# EAGLE board M7010X (EAGLE 6.6.0)
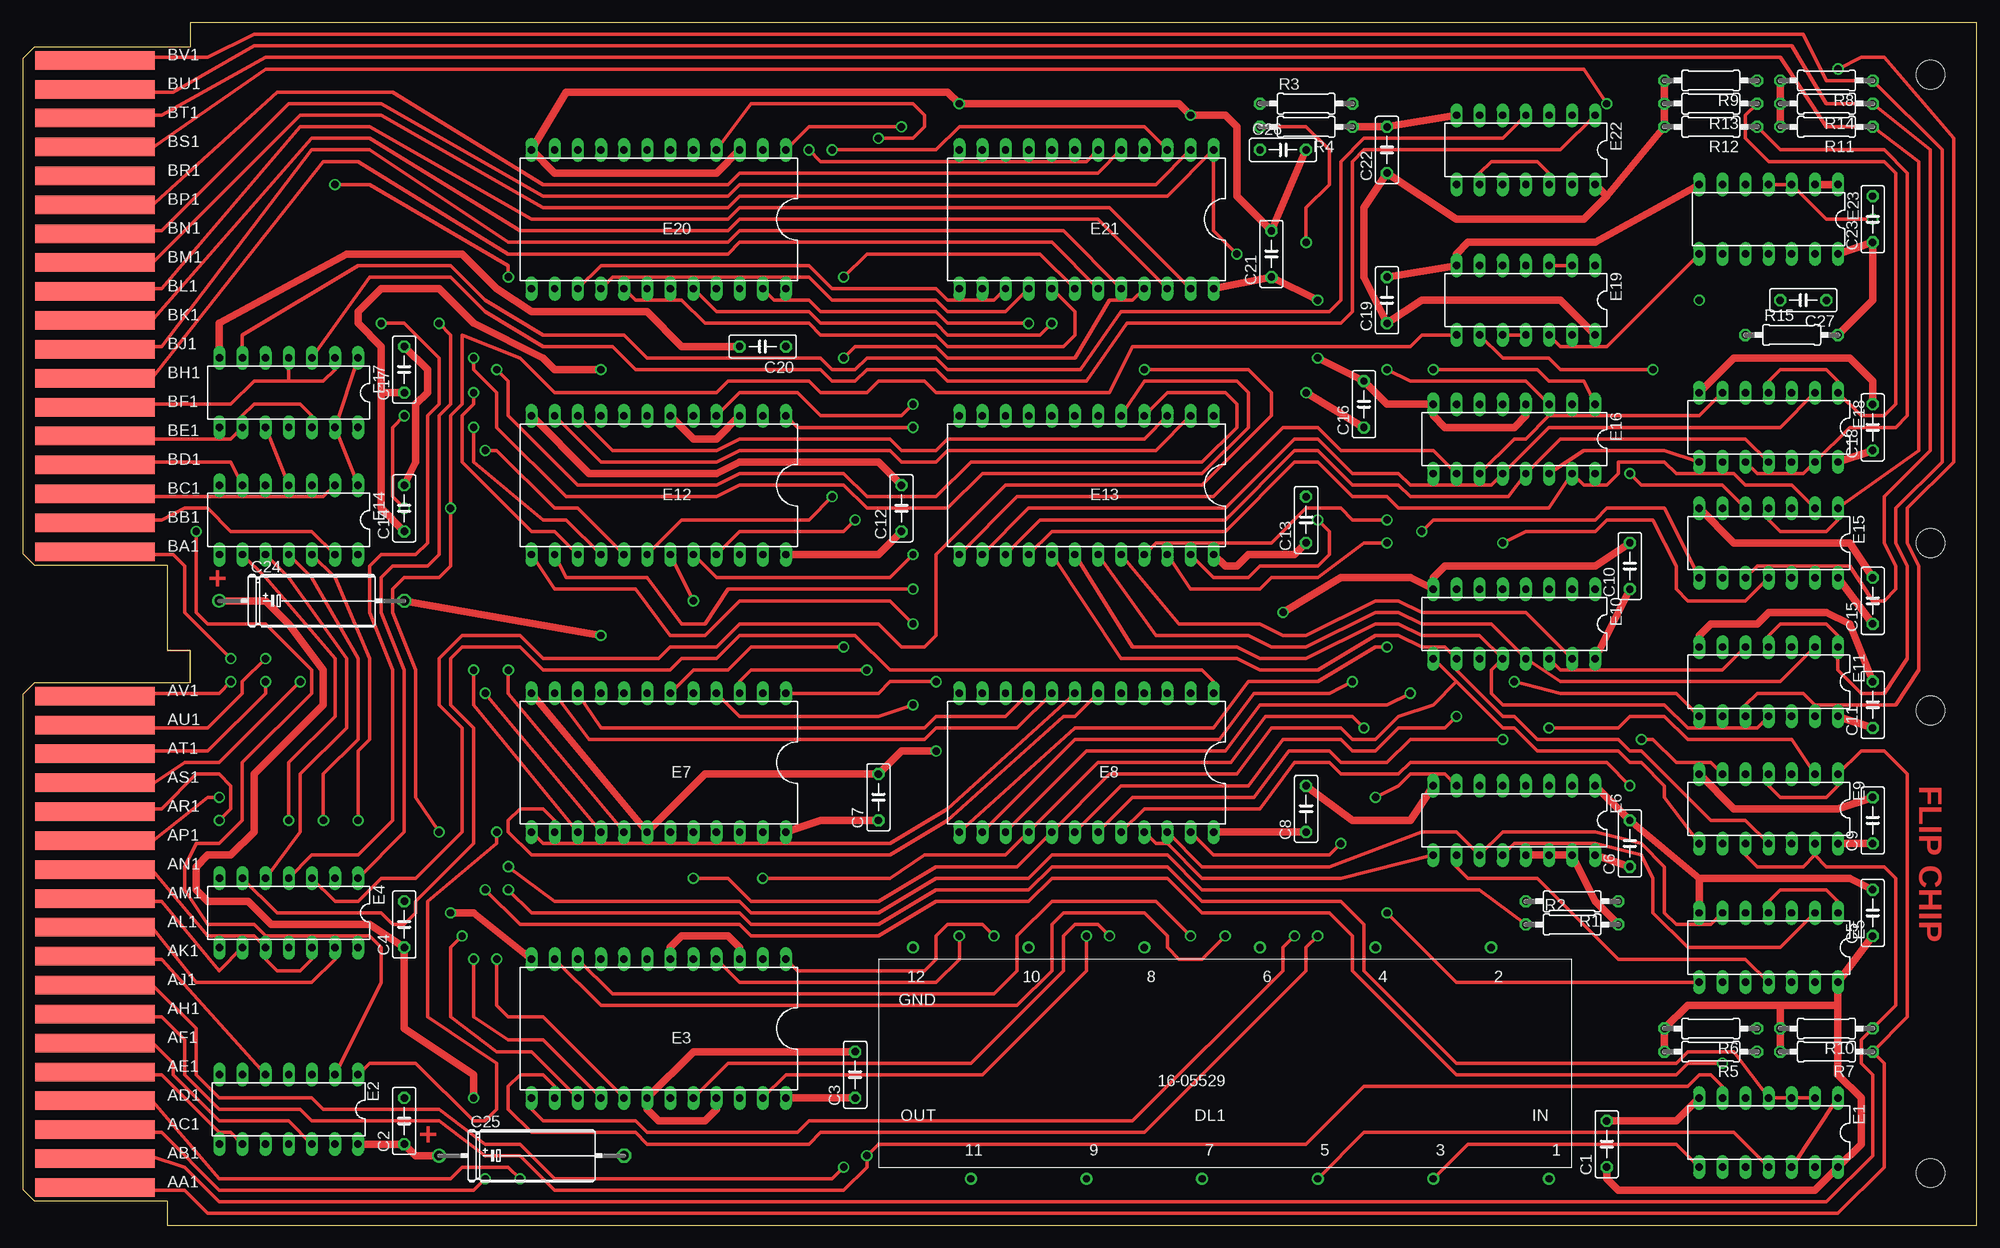
[diagram p2: board, top side]
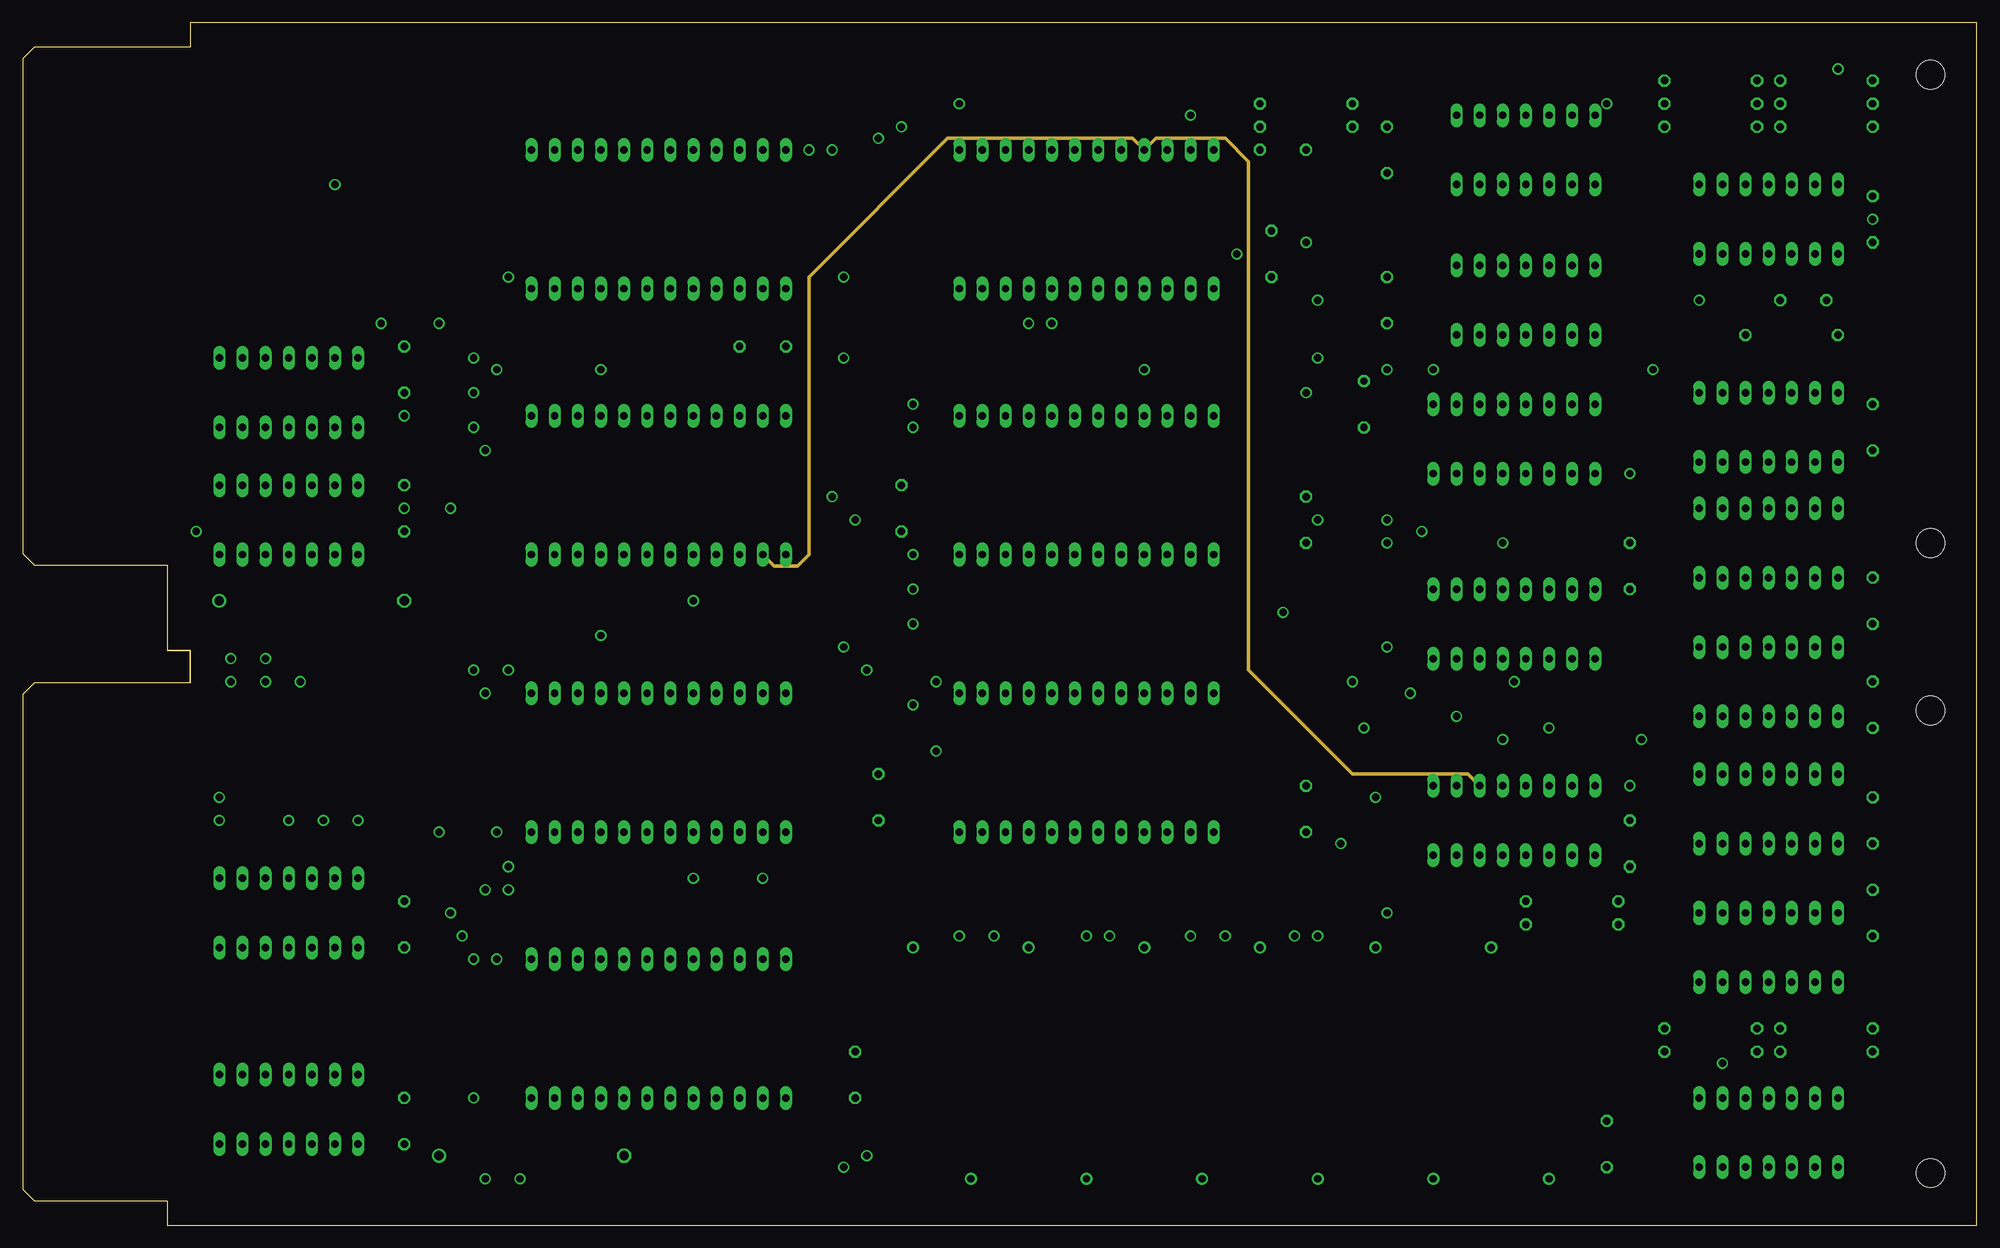
[diagram p3: board, inner layer ECO]
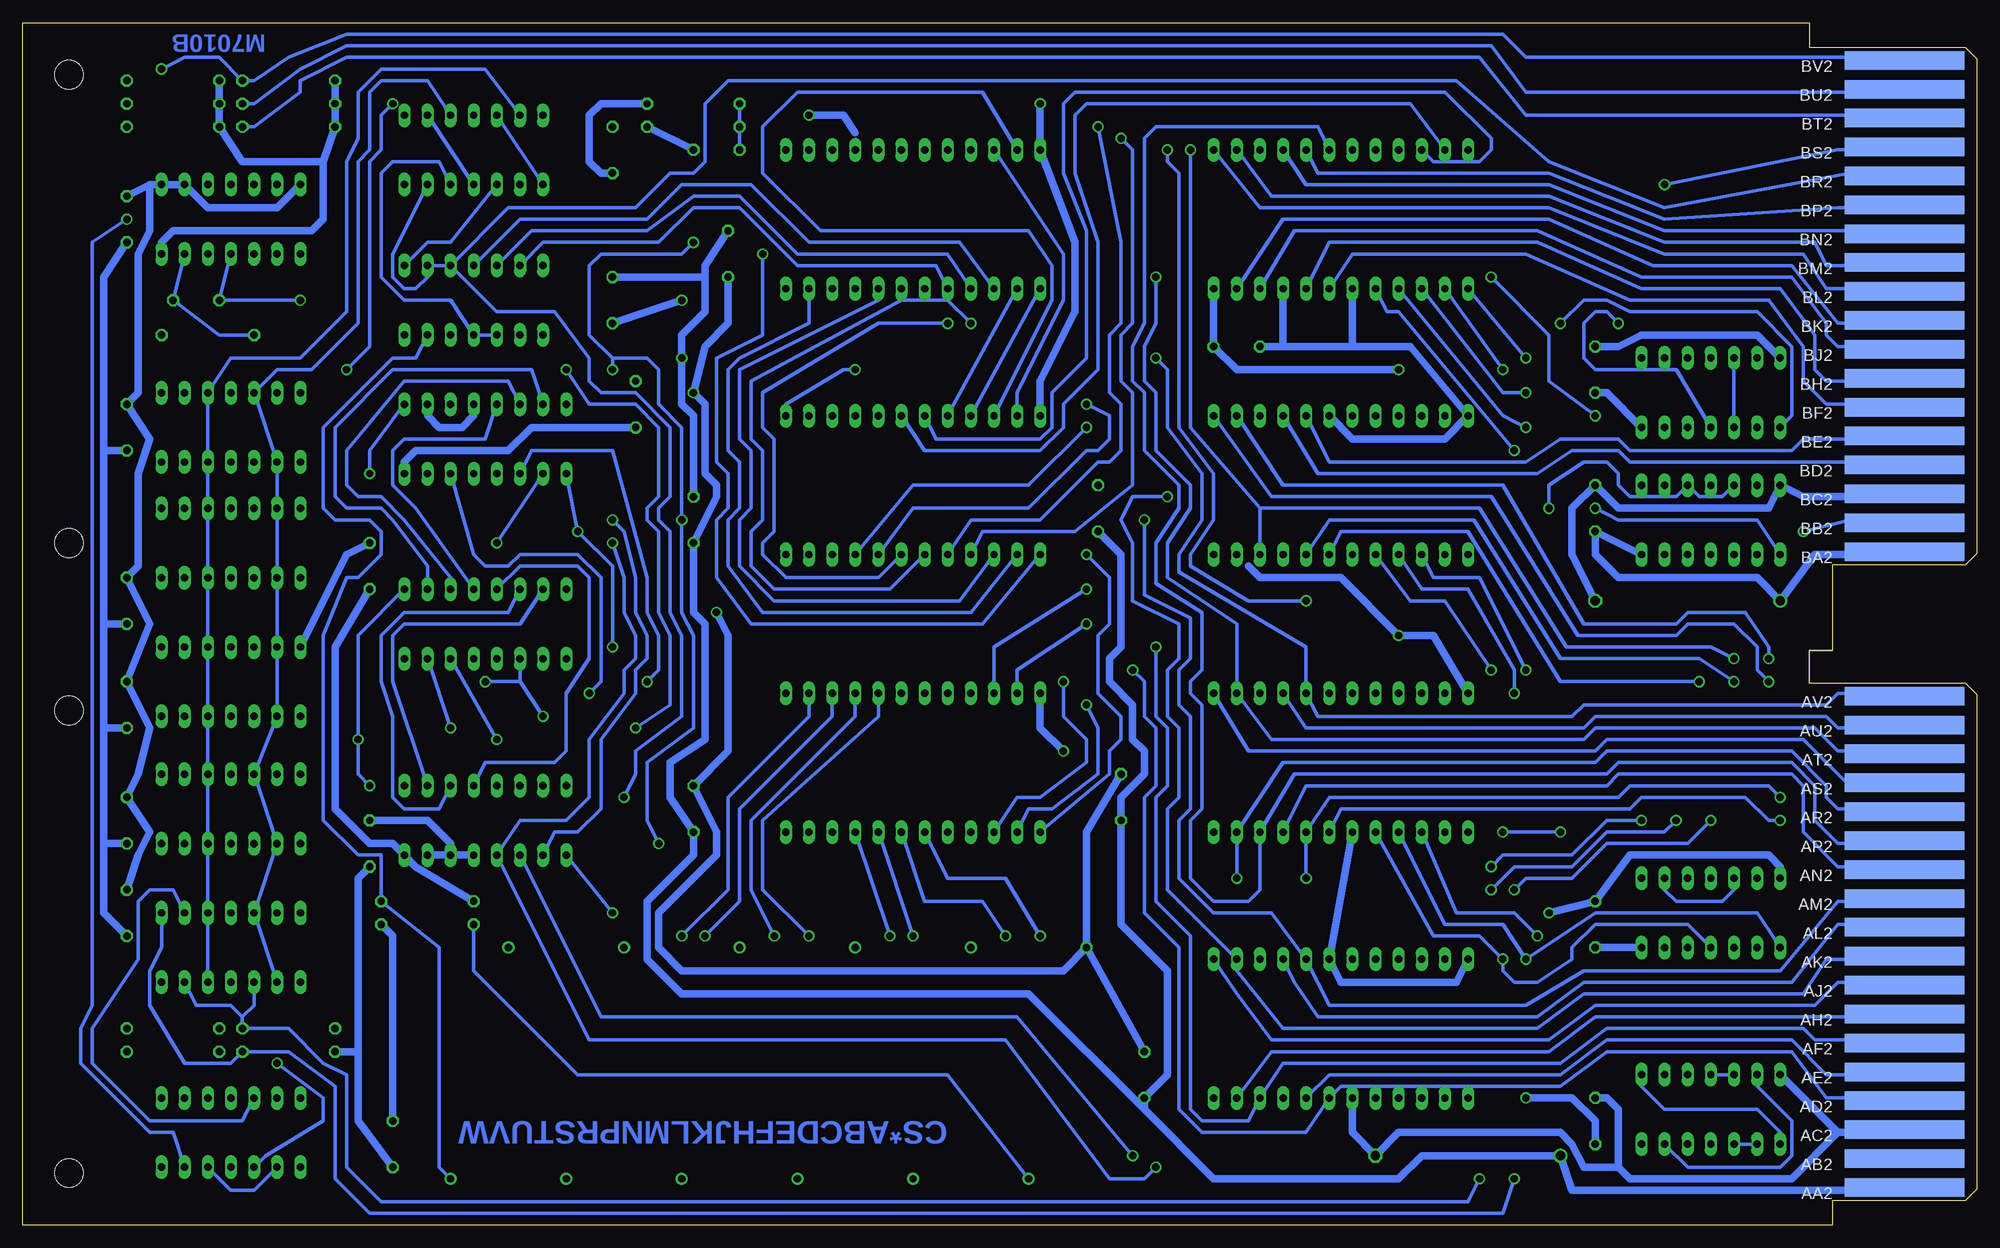
[diagram p4: board, bottom side, seen from below]

Size 214.63 x 132.08 mm. Coordinates in mm from the lower left corner, seen from the top.
Copper layers (1+2+16): Top 0.035mm / dielectric 1.5mm / ECO 0.035mm / dielectric 0.15mm / Bottom 0.035mm
Design rules "16mils *": minimum track width 16mil, minimum drill 32mil, track to track 15mil, track to pad 10mil, pad to pad 10mil, via to via 10mil, smd to smd 10mil, copper to edge 13mil, drill to drill 10mil, minimum pad ring 10mil, minimum via ring 8mil, stop-mask expansion 0mil, vias tented up to drill 0mil, thermal gap 10mil
Net classes: 1 supply: width 0.813 mm

## Footprints (pad centres in the part's own frame; a part is rotated, then mirrored left to right if it is on the bottom)
C050-025X075 = drill 0.813 octagon: 1 -2.54,0; 2 2.54,0
E12-8 = drill 1.016: + -10.16,0 | drill 1.016 octagon: - 10.16,0
16-05529 = drill 0.813: 1 -35.56,12.7; 2 -29.21,-12.7; 3 -22.86,12.7; 4 -16.51,-12.7; 5 -10.16,12.7; 6 -3.81,-12.7; 7 2.54,12.7; 8 8.89,-12.7; 9 15.24,12.7; 10 21.59,-12.7; 11 27.94,12.7; 12 34.29,-12.7
DIL14 = drill 0.813 long: 1 -7.62,-3.81; 2 -5.08,-3.81; 3 -2.54,-3.81; 4 0,-3.81; 5 2.54,-3.81; 6 5.08,-3.81; 7 7.62,-3.81; 8 7.62,3.81; 9 5.08,3.81; 10 2.54,3.81; 11 0,3.81; 12 -2.54,3.81; 13 -5.08,3.81; 14 -7.62,3.81
DIL24 = drill 0.813 long: 1 -12.7,-7.62; 2 -10.16,-7.62; 3 -7.62,-7.62; 4 -5.08,-7.62; 5 -2.54,-7.62; 6 0,-7.62; 7 2.54,-7.62; 8 5.08,-7.62; 9 7.62,-7.62; 10 10.16,-7.62; 11 12.7,-7.62; 12 15.24,-7.62; 13 15.24,7.62; 14 12.7,7.62; 15 10.16,7.62; 16 7.62,7.62; 17 5.08,7.62; 18 2.54,7.62; 19 0,7.62; 20 -2.54,7.62; 21 -5.08,7.62; 22 -7.62,7.62; 23 -10.16,7.62; 24 -12.7,7.62
DIL16 = drill 0.813 long: 1 -8.89,-3.81; 2 -6.35,-3.81; 3 -3.81,-3.81; 4 -1.27,-3.81; 5 1.27,-3.81; 6 3.81,-3.81; 7 6.35,-3.81; 8 8.89,-3.81; 9 8.89,3.81; 10 6.35,3.81; 11 3.81,3.81; 12 1.27,3.81; 13 -1.27,3.81; 14 -3.81,3.81; 15 -6.35,3.81; 16 -8.89,3.81
0207/10 = drill 0.813 octagon: 1 -5.08,0; 2 5.08,0
DOUBLE-LONG = hole 3.175: 209.55,56.515; 209.55,5.715; 209.55,74.93; 209.55,126.365
EDGE-CON4 = smd 13.106 x 2.032: AA1 7.938,4.128; AB1 7.938,7.303; AC1 7.938,10.477; AD1 7.938,13.652; AE1 7.938,16.828; AF1 7.938,20.003; AH1 7.938,23.177; AJ1 7.938,26.352; AK1 7.938,29.527; AL1 7.938,32.703; AM1 7.938,35.877; AN1 7.938,39.053; AP1 7.938,42.227; AR1 7.938,45.403; AS1 7.938,48.578; AT1 7.938,51.752; AU1 7.938,54.928; AV1 7.938,58.102; BA1 7.938,73.978; BB1 7.938,77.153; BC1 7.938,80.328; BD1 7.938,83.502; BE1 7.938,86.677; BF1 7.938,89.853; BH1 7.938,93.028; BJ1 7.938,96.203; BK1 7.938,99.377; BL1 7.938,102.552; BM1 7.938,105.728; BN1 7.938,108.903; BP1 7.938,112.078; BR1 7.938,115.252; BS1 7.938,118.427; BT1 7.938,121.603; BU1 7.938,124.778; BV1 7.938,127.953 | smd 13.106 x 2.032 bottom: AA2 7.938,4.128; AB2 7.938,7.303; AC2 7.938,10.477; AD2 7.938,13.652; AE2 7.938,16.828; AF2 7.938,20.003; AH2 7.938,23.177; AJ2 7.938,26.352; AK2 7.938,29.527; AL2 7.938,32.703; AM2 7.938,35.877; AN2 7.938,39.053; AP2 7.938,42.227; AR2 7.938,45.403; AS2 7.938,48.578; AT2 7.938,51.752; AU2 7.938,54.928; AV2 7.938,58.102; BA2 7.938,73.978; BB2 7.938,77.153; BC2 7.938,80.328; BD2 7.938,83.502; BE2 7.938,86.677; BF2 7.938,89.853; BH2 7.938,93.028; BJ2 7.938,96.203; BK2 7.938,99.377; BL2 7.938,102.552; BM2 7.938,105.728; BN2 7.938,108.903; BP2 7.938,112.078; BR2 7.938,115.252; BS2 7.938,118.427; BT2 7.938,121.603; BU2 7.938,124.778; BV2 7.938,127.953

## Placement (x,y rotation side)
C1  .01uF  [C050-025X075]  173.99,8.89 90 top
C2  .01uF  [C050-025X075]  41.91,11.43 90 top
C3  .01uF  [C050-025X075]  91.44,16.51 90 top
C4  .01uF  [C050-025X075]  41.91,33.02 90 top
C5  .01uF  [C050-025X075]  203.2,34.29 90 top
C6  .01uF  [C050-025X075]  176.53,41.91 90 top
C7  .01uF  [C050-025X075]  93.98,46.99 90 top
C8  .01uF  [C050-025X075]  140.97,45.72 90 top
C9  .01uF  [C050-025X075]  203.2,44.45 90 top
C10  .01uF  [C050-025X075]  176.53,72.39 90 top
C11  .01uF  [C050-025X075]  203.2,57.15 90 top
C12  .01uF  [C050-025X075]  96.52,78.74 90 top
C13  .01uF  [C050-025X075]  140.97,77.47 90 top
C14  .01uF  [C050-025X075]  41.91,78.74 90 top
C15  .01uF  [C050-025X075]  203.2,68.58 90 top
C16  .01uF  [C050-025X075]  147.32,90.17 90 top
C17  .01uF  [C050-025X075]  41.91,93.98 90 top
C18  .01uF  [C050-025X075]  203.2,87.63 90 top
C19  .01uF  [C050-025X075]  149.86,101.6 90 top
C20  .01uF  [C050-025X075]  81.28,96.52 180 top
C21  .01uF  [C050-025X075]  137.16,106.68 90 top
C22  .01uF  [C050-025X075]  149.86,118.11 90 top
C23  .01uF  [C050-025X075]  203.2,110.49 90 top
C24  6.8uF  [E12-8]  31.75,68.58 0 top
C25  6.8uF  [E12-8]  55.88,7.62 0 top
C26  .01uF  [C050-025X075]  138.43,118.11 0 top
C27  10pF  [C050-025X075]  195.58,101.6 180 top
DL1  16-05529  [16-05529]  132.08,17.78 180 top
E1  7402N  [DIL14]  191.77,10.16 180 top
E2  7440N  [DIL14]  29.21,12.7 180 top
E3  N8263  [DIL24]  71.12,21.59 180 top
E4  7400N  [DIL14]  29.21,34.29 180 top
E5  7401N  [DIL14]  191.77,30.48 180 top
E6  7485N  [DIL16]  163.83,44.45 180 top
E7  N8263  [DIL24]  71.12,50.8 180 top
E8  N8202  [DIL24]  118.11,50.8 180 top
E9  7401N  [DIL14]  191.77,45.72 180 top
E10  7485N  [DIL16]  163.83,66.04 180 top
E11  7401N  [DIL14]  191.77,59.69 180 top
E12  N8263  [DIL24]  71.12,81.28 180 top
E13  N8202  [DIL24]  118.11,81.28 180 top
E14  7402N  [DIL14]  29.21,77.47 180 top
E15  7401N  [DIL14]  191.77,74.93 180 top
E16  7485N  [DIL16]  163.83,86.36 180 top
E17  7400N  [DIL14]  29.21,91.44 180 top
E18  7401N  [DIL14]  191.77,87.63 180 top
E19  7402N  [DIL14]  165.1,101.6 180 top
E20  N8263  [DIL24]  71.12,110.49 180 top
E21  N8263  [DIL24]  118.11,110.49 180 top
E22  7400N  [DIL14]  165.1,118.11 180 top
E23  9601  [DIL14]  191.77,110.49 180 top
R1  100  [0207/10]  170.18,35.56 180 top
R2  100  [0207/10]  170.18,33.02 0 top
R3  330  [0207/10]  140.97,123.19 0 top
R4  750  [0207/10]  140.97,120.65 180 top
R5  1K  [0207/10]  185.42,19.05 180 top
R6  1K  [0207/10]  185.42,21.59 180 top
R7  1K  [0207/10]  198.12,19.05 180 top
R8  1K  [0207/10]  198.12,125.73 180 top
R9  1K  [0207/10]  185.42,125.73 180 top
R10  1K  [0207/10]  198.12,21.59 180 top
R11  1K  [0207/10]  198.12,120.65 180 top
R12  1K  [0207/10]  185.42,120.65 180 top
R13  1K  [0207/10]  185.42,123.19 180 top
R14  1K  [0207/10]  198.12,123.19 180 top
R15  4.7K  [0207/10]  194.31,97.79 0 top
U$1  OUTLINE-DOUBLE-LONG  [DOUBLE-LONG]  0,0 0 top
U$3  [EDGE-CON4]  0,0 0 top

## Tracks (layer width: path | path; a pad name or v marks a point on that pad's centre or on a via)
+3V3  (via drill 0.81)
  Top 0.406: E8.23 130.81,40.64 143.51,40.64 v144.78,41.91 | E13.23 130.81,71.12 134.62,71.12 135.89,72.39 142.24,72.39 143.51,73.66 143.51,76.2 v142.24,77.47 | v140.97,107.95 140.97,111.76 143.51,114.3 143.51,118.11 140.97,120.65 R4.2 | E16.3 165.1,92.71 152.4,92.71 v149.86,93.98
  Bottom 0.406: C26.1 R4.2 R3.1 | v140.97,107.95 142.24,106.68 151.13,106.68 152.4,105.41 152.4,97.79 149.86,95.25 | 149.86,95.25 v149.86,93.98 | 149.86,95.25 146.05,95.25 144.78,93.98 144.78,90.17 142.24,87.63 v142.24,77.47 142.24,67.31 140.97,64.77 140.97,54.61 146.05,50.8 146.05,44.45 v144.78,41.91
GND  (via drill 0.81)
  Top 0.813: E17.7 21.59,99.06 35.56,106.68 48.26,106.68 52.07,102.87 55.88,100.33 68.58,100.33 72.39,96.52 C20.2 | E22.7 C22.2 R4.1 | C19.2 E19.7 157.48,106.68 158.75,107.95 172.72,107.95 E23.7 | C17.2 44.45,93.98 44.45,91.44 43.18,90.17 43.18,83.82 C14.2 | C24.- v63.5,64.77 | C1.2 181.61,11.43 E1.7 | E7.12 E7.18 74.93,49.53 C7.2 96.52,52.07 v100.33,52.07 | v46.99,34.29 49.53,34.29 E3.12 | E6.8 152.4,44.45 146.05,44.45 C8.2 | v138.43,67.31 144.78,71.12 152.4,71.12 E10.8 154.94,71.12 156.21,72.39 172.72,72.39 C10.2 | E5.7 184.15,38.1 | 184.15,38.1 200.66,38.1 C5.2 | 184.15,38.1 C6.2 E6.1 | R2.2 172.72,35.56 E6.15 E6.14 E6.13 | C3.2 73.66,19.05 E3.18 68.58,12.7 69.85,11.43 74.93,11.43 76.2,12.7 E3.21 | E3.6 71.12,30.48 72.39,31.75 77.47,31.75 78.74,30.48 E3.3 | C12.2 93.98,83.82 78.74,83.82 76.2,82.55 62.23,82.55 E12.12 | C26.2 C21.2 133.35,113.03 133.35,120.65 132.08,121.92 v128.27,121.92 127,123.19 v102.87,123.19 101.6,124.46 59.69,124.46 E20.12 58.42,115.57 76.2,115.57 E20.3 | E23.2 E23.1 | E16.4 165.1,88.9 163.83,87.63 156.21,87.63 154.94,88.9 E16.8 149.86,90.17 C16.2 v142.24,95.25 | E18.7 187.96,95.25 200.66,95.25 203.2,92.71 C18.2 | E15.7 187.96,74.93 200.66,74.93 C15.2 | E11.7 184.15,64.77 185.42,66.04 190.5,66.04 191.77,67.31 198.12,67.31 200.66,66.04 C11.2 | E12.3 76.2,86.36 73.66,86.36 E12.6 | E9.7 187.96,45.72 199.39,45.72 C9.2
  Bottom 0.813: U$3.AC2 8.89,10.16 15.24,10.16 | 15.24,10.16 20.32,5.08 38.1,5.08 39.37,6.35 | 39.37,6.35 39.37,12.7 40.64,13.97 C2.2 | 39.37,6.35 43.18,6.35 44.45,8.89 45.72,10.16 63.5,10.16 C25.- 68.58,10.16 E3.18 | E2.7 15.24,10.16 | DL1.12 C3.2 | R2.2 173.99,31.75 C1.2 | DL1.12 97.79,43.18 C7.2 | DL1.12 100.33,27.94 142.24,27.94 144.78,30.48 144.78,34.29 138.43,40.64 138.43,43.18 C8.2 137.16,52.07 137.16,64.77 v138.43,67.31 | C24.- 44.45,73.66 44.45,78.74 C14.2 39.37,78.74 22.86,78.74 E14.7 19.05,80.01 10.16,80.01 U$3.BC2 | E3.12 57.15,26.67 69.85,26.67 E3.6 E7.18 | E4.7 21.59,39.37 22.86,40.64 38.1,40.64 C4.2 v46.99,34.29 | E7.12 59.69,64.77 v63.5,64.77 69.85,71.12 78.74,71.12 80.01,72.39 | C20.2 76.2,96.52 | 76.2,96.52 68.58,96.52 | 68.58,96.52 E20.18 | E20.21 76.2,96.52 | 68.58,96.52 62.23,96.52 E12.12 58.42,86.36 68.58,86.36 E12.6 | E17.7 24.13,97.79 36.83,97.79 39.37,96.52 C17.2 | E8.12 102.87,54.61 v100.33,52.07 | E13.12 102.87,92.71 99.06,100.33 99.06,107.95 E21.12 v102.87,123.19 | C26.2 R4.1 | C6.2 170.18,44.45 167.64,41.91 E6.14 | E6.15 E6.14 | E6.13 E6.14 | C10.2 179.07,73.66 E11.7 | C13.2 140.97,88.9 142.24,90.17 v142.24,95.25 142.24,97.79 139.7,100.33 139.7,104.14 | 139.7,104.14 139.7,105.41 C21.2 | C19.2 139.7,104.14 | E16.4 165.1,88.9 166.37,87.63 168.91,87.63 170.18,88.9 E16.2 | E23.7 186.69,111.76 194.31,111.76 E23.2 E23.1 200.66,114.3 | C23.2 200.66,114.3 | 200.66,114.3 200.66,109.22 201.93,106.68 201.93,91.44 C18.2 200.66,86.36 201.93,82.55 201.93,72.39 C15.2 200.66,66.04 C11.2 200.66,54.61 201.93,49.53 C9.2 200.66,43.18 201.93,40.64 C5.2 | v128.27,121.92 124.46,121.92 123.19,120.02
N$1  (via drill 0.81)
  Top 0.406: E5.8 157.48,26.67 v149.86,34.29 | E8.21 124.46,41.91 125.73,41.91 129.54,38.1 144.78,38.1 E6.9 | v119.38,31.75 118.11,33.02 115.57,33.02 114.3,31.75 114.3,27.94 104.14,17.78 77.47,17.78 E3.20
  Bottom 0.406: E3.20 71.12,16.51 45.72,16.51 40.64,20.32 20.32,20.32 16.51,16.51 8.89,16.51 U$3.AE2 | E8.21 v119.38,31.75 | E6.9 v149.86,34.29
N$2  (via drill 0.81)
  Top 0.406: E8.20 123.19,45.72 135.89,45.72 139.7,50.8 143.51,50.8 144.78,49.53 151.13,49.53 152.4,50.8 173.99,50.8 v176.53,48.26 | v116.84,31.75 116.84,27.94 105.41,16.51 83.82,16.51 E3.23 | E9.6 185.42,50.8 181.61,50.8 179.07,53.34 v177.8,53.34
  Bottom 0.406: E3.23 77.47,19.05 46.99,19.05 41.91,22.86 8.89,22.86 U$3.AH2 | E8.20 v116.84,31.75 | E10.1 177.8,64.77 v177.8,53.34 177.8,49.53 v176.53,48.26
N$3  (via drill 0.81)
  Top 0.406: E8.19 121.92,46.99 135.26,46.99 139.07,52.07 143.51,52.07 144.78,50.8 149.86,50.8 152.4,53.34 v162.56,53.34 | v106.68,31.75 105.41,33.02 101.6,33.02 100.33,31.75 100.33,29.21 99.06,27.94 85.09,27.94 E3.1 | E10.14 168.91,60.96 186.69,60.96 E11.5
  Bottom 0.406: U$3.AJ2 8.89,26.67 15.24,26.67 17.78,24.13 41.91,24.13 46.99,20.32 77.47,20.32 81.28,25.4 E3.1 | E8.19 115.57,35.56 109.22,35.56 v106.68,31.75 | E10.14 v162.56,53.34
N$4  (via drill 0.81)
  Top 0.406: E8.18 120.65,48.26 134.62,48.26 138.43,53.34 144.78,53.34 146.05,52.07 148.59,52.07 151.13,54.61 156.21,54.61 v157.48,55.88 | v102.87,31.75 102.87,29.21 100.33,26.67 78.74,26.67 E3.4 | v163.83,59.69 168.91,58.42 181.61,58.42 E11.8
  Bottom 0.406: U$3.AL2 8.89,33.02 15.24,33.02 20.32,26.67 43.18,26.67 48.26,22.86 72.39,22.86 74.93,26.67 E3.4 | E8.18 113.03,38.1 106.68,38.1 v102.87,31.75 | E10.11 160.02,59.69 | 160.02,59.69 v157.48,55.88 | 160.02,59.69 v163.83,59.69
N$5  (via drill 0.81)
  Top 0.406: E7.3 78.74,59.69 80.01,60.96 v92.71,60.96
  Bottom 0.406: U$3.AD2 10.16,13.97 16.51,13.97 20.32,19.05 40.64,19.05 45.72,15.24 69.85,15.24 E3.19 73.66,10.16 85.09,10.16 87.63,12.7 87.63,30.48 91.44,34.29 91.44,46.99 90.17,48.26 90.17,54.61 91.44,55.88 91.44,59.69 v92.71,60.96
N$6  (via drill 0.81)
  Top 0.406: E7.6 73.66,60.96 77.47,60.96 80.01,63.5 v90.17,63.5
  Bottom 0.406: U$3.AF2 8.89,20.32 17.78,20.32 19.05,21.59 40.64,21.59 45.72,17.78 76.2,17.78 E3.22 80.01,11.43 85.09,11.43 86.36,12.7 86.36,31.75 90.17,35.56 90.17,46.99 88.9,48.26 88.9,54.61 90.17,55.88 v90.17,63.5
N$7  (via drill 0.81)
  Top 0.406: v88.9,80.01 86.36,77.47 72.39,77.47 E12.18
  Bottom 0.406: U$3.AK2 8.89,29.21 16.51,29.21 19.05,25.4 43.18,25.4 48.26,21.59 76.2,21.59 81.28,27.94 E3.2 88.9,36.83 88.9,45.72 87.63,46.99 87.63,54.61 88.9,55.88 88.9,60.96 87.63,62.23 87.63,66.04 92.71,68.58 92.71,74.93 93.98,77.47 92.71,80.01 v88.9,80.01
N$8  (via drill 0.81)
  Top 0.406: v91.44,77.47 90.17,76.2 78.74,76.2 E12.21
  Bottom 0.406: U$3.AM2 8.89,35.56 15.24,35.56 21.59,27.94 43.18,27.94 49.53,24.13 71.12,24.13 E3.5 77.47,34.29 83.82,34.29 87.63,38.1 87.63,44.45 86.36,45.72 86.36,55.88 87.63,57.15 87.63,60.96 86.36,62.23 86.36,66.67 91.44,69.22 v91.44,77.47
N$9
  Bottom 0.406: U$3.AN2 8.89,39.37 15.24,39.37 19.05,43.18 19.05,48.26 20.32,49.53 39.37,49.53 40.64,48.26 73.66,48.26 E7.21
N$10  (via drill 0.81)
  Top 0.406: E21.15 106.68,101.6 101.6,101.6 100.33,102.87 88.9,102.87 86.36,105.41 63.5,105.41 E20.15 | E7.15 49.53,57.15 v49.53,60.96 | v49.53,91.44 49.53,90.17 48.26,88.9 48.26,83.82 55.88,76.2 58.42,76.2 E12.15 | E3.15 55.88,19.05 52.07,19.05 46.99,22.86 46.99,30.48 v48.26,31.75
  Bottom 0.406: E7.15 57.15,34.29 50.8,34.29 v48.26,31.75 | E12.15 59.69,71.12 54.61,71.12 v49.53,60.96 | E21.15 111.76,107.95 128.27,107.95 134.62,114.3 142.24,114.3 146.05,110.49 160.02,110.49 E19.4 | E20.15 52.07,91.44 v49.53,91.44
N$11  (via drill 0.81)
  Top 0.406: E20.17 67.31,101.6 72.39,101.6 74.93,99.06 86.36,99.06 87.63,97.79 100.33,97.79 101.6,96.52 114.3,96.52 115.57,97.79 115.57,100.33 E21.17 | E7.17 53.34,58.42 v53.34,60.96 | v50.8,85.09 52.07,85.09 58.42,78.74 60.96,78.74 E12.17 | E3.17 57.15,22.86 53.34,22.86 52.07,24.13 v52.07,29.21
  Bottom 0.406: E4.11 31.75,33.02 41.91,33.02 44.45,30.48 44.45,29.21 48.26,26.67 50.8,26.67 52.07,27.94 v52.07,29.21 54.61,31.75 59.69,31.75 E7.17 | E12.17 62.23,68.58 58.42,68.58 v53.34,60.96 | E19.6 157.48,107.95 144.78,107.95 140.97,111.76 135.89,111.76 129.54,105.41 114.3,105.41 E21.17 | E20.17 64.77,100.33 63.5,100.33 v50.8,85.09
N$12  (via drill 0.81)
  Top 0.406: E21.16 107.95,100.33 101.6,100.33 100.33,101.6 88.9,101.6 86.36,104.14 64.77,104.14 E20.16 | E7.16 v50.8,58.42 | v49.53,87.63 49.53,83.82 57.15,77.47 59.69,77.47 E12.16 | E3.16 57.15,20.32 53.34,20.32 49.53,22.86 v49.53,29.21
  Bottom 0.406: E4.8 24.13,34.29 41.91,34.29 v49.53,29.21 52.07,33.02 58.42,33.02 E7.16 | E12.16 60.96,69.85 55.88,69.85 50.8,60.96 v50.8,58.42 | E21.16 113.03,106.68 129.54,106.68 135.89,113.03 140.97,113.03 146.05,109.22 158.75,109.22 E19.5 | E20.16 52.07,88.9 v49.53,87.63
N$13  (via drill 0.81)
  Top 0.406: E21.21 121.92,101.6 119.38,101.6 115.57,95.25 101.6,95.25 100.33,96.52 91.44,96.52 v90.17,95.25
  Bottom 0.406: U$3.AV2 8.89,58.42 15.24,58.42 16.51,57.15 43.18,57.15 44.45,55.88 72.39,55.88 E7.5 73.66,63.5 87.63,71.75 87.63,73.66 85.09,77.47 85.09,82.55 88.9,87.63 88.9,93.98 v90.17,95.25
N$14  (via drill 0.81)
  Top 0.406: v90.17,104.14 92.71,106.68 111.76,106.68 E21.18
  Bottom 0.406: U$3.AT2 8.89,52.07 15.24,52.07 17.78,54.61 41.91,54.61 43.18,53.34 77.47,53.34 E7.2 81.28,66.04 88.9,71.12 88.9,74.93 86.36,78.74 86.36,81.28 90.17,85.09 90.17,91.44 91.44,92.71 91.44,96.52 90.17,99.06 v90.17,104.14
N$15
  Bottom 0.406: U$3.AP2 8.89,41.91 15.24,41.91 17.78,44.45 17.78,48.26 20.32,50.8 39.37,50.8 40.64,49.53 74.93,49.53 E7.22 78.74,36.83 80.01,35.56 83.82,35.56 86.36,38.1 86.36,44.45 85.09,45.72 85.09,57.15 86.36,58.42 86.36,59.69 85.09,60.96 85.09,67.31 90.17,70.48 90.17,74.93 87.63,78.74 87.63,81.28 91.44,85.09 91.44,91.44 92.71,92.71 92.71,96.52 91.44,99.06 91.44,119.38 90.17,120.65 72.39,120.65 E20.6
N$16  (via drill 0.81)
  Top 0.406: U$3.AP1 8.89,41.91 13.97,41.91 20.32,46.99 v21.59,46.99 | v73.66,38.1 77.47,38.1 80.01,35.56 93.98,35.56 100.33,39.37 109.22,39.37 E8.17 119.38,49.53 133.35,49.53 137.16,54.61 144.78,54.61 146.05,53.34 148.59,53.34 151.13,55.88 154.94,57.15 157.48,59.69 | E10.9 157.48,59.69 | 157.48,59.69 162.56,54.61 163.83,54.61 166.37,52.07 175.26,52.07 176.53,50.8 177.8,50.8 180.34,48.26 180.34,46.99 E9.8
  Bottom 0.406: v73.66,38.1 E7.20 71.12,46.99 39.37,46.99 38.1,48.26 22.86,48.26 v21.59,46.99
N$17  (via drill 0.81)
  Top 0.406: v50.8,36.83 54.61,33.02 78.74,33.02 80.01,31.75 93.98,31.75 100.33,35.56 110.49,35.56 113.03,38.1 125.73,38.1 129.54,34.29 143.51,34.29 146.05,31.75 146.05,27.94 157.48,16.51 181.61,16.51 182.88,17.78 v186.69,17.78 | E14.9 26.67,71.12 34.29,62.23 34.29,55.88 29.21,50.8 v29.21,44.45
  Bottom 0.406: v29.21,44.45 31.75,41.91 40.64,41.91 44.45,38.1 49.53,38.1 v50.8,36.83 | E1.10 187.96,7.62 181.61,11.43 181.61,13.97 v186.69,17.78
N$18  (via drill 0.81)
  Top 0.406: E8.15 116.84,52.07 132.08,52.07 135.89,57.15 149.86,57.15 v152.4,58.42 | E18.8 180.34,85.09 171.45,85.09 E16.14 | E7.1 93.98,58.42 95.25,59.69 v100.33,59.69
  Bottom 0.406: U$3.AS2 10.16,48.26 13.97,48.26 19.05,53.34 40.64,53.34 41.91,52.07 80.01,52.07 E7.1 | E8.15 105.41,46.99 102.87,46.99 97.79,50.8 97.79,53.34 100.33,55.88 v100.33,59.69 | E16.14 165.1,73.66 163.83,72.39 161.29,72.39 160.02,73.66 153.67,73.66 151.13,71.12 151.13,59.69 v152.4,58.42
N$19  (via drill 0.81)
  Top 0.406: E15.5 186.69,81.28 177.8,81.28 v176.53,82.55 | v81.28,38.1 95.25,38.1 99.06,40.64 107.95,40.64 E8.16 118.11,50.8 132.72,50.8 136.53,55.88 146.05,55.88 v147.32,54.61 | v154.94,93.98 166.37,93.98 167.64,92.71 171.45,92.71 E16.1
  Bottom 0.406: v81.28,38.1 E7.23 76.2,50.8 41.91,50.8 40.64,52.07 20.32,52.07 16.51,48.26 16.51,46.99 15.24,45.72 8.89,45.72 U$3.AR2 | E16.1 176.53,85.09 v176.53,82.55 | v147.32,54.61 143.51,57.15 143.51,64.77 144.78,67.31 144.78,76.2 146.05,77.47 146.05,78.74 144.78,80.01 144.78,87.63 147.32,90.17 152.4,90.17 v154.94,93.98
N$20  (via drill 0.81)
  Top 0.406: v21.59,44.45 22.86,45.72 22.86,48.26 21.59,49.53 19.05,49.53 15.24,45.72 8.89,45.72 U$3.AR1
  Bottom 0.406: E7.19 69.85,45.72 38.1,45.72 36.83,46.99 25.4,46.99 22.86,44.45 v21.59,44.45
N$21
  Top 0.406: E7.14 58.42,44.45 57.15,45.72 54.61,45.72 53.34,44.45 53.34,43.18 55.88,40.64 95.25,40.64 101.6,44.45 114.3,55.88 115.57,55.88 E8.6
N$22
  Top 0.406: E7.13 57.15,41.91 95.25,41.91 101.6,45.72 E8.7
N$23
  Top 0.406: E7.11 62.23,53.34 99.06,53.34 100.33,54.61 109.22,54.61 E8.8
N$24
  Top 0.406: E7.10 63.5,54.61 99.06,54.61 100.33,55.88 107.95,55.88 E8.9
N$25  (via drill 0.81)
  Top 0.406: v128.27,31.75 124.46,35.56 113.03,35.56 109.22,31.75 109.22,27.94 106.68,25.4 64.77,25.4 E3.10
  Bottom 0.406: E8.5 120.65,55.88 133.35,44.45 133.35,36.83 v128.27,31.75
N$26  (via drill 0.81)
  Top 0.406: v132.08,31.75 129.54,29.21 127,29.21 125.73,30.48 125.73,31.75 123.19,34.29 114.3,34.29 113.03,33.02 113.03,27.94 109.22,24.13 63.5,24.13 E3.11
  Bottom 0.406: E8.4 123.19,55.88 134.62,44.45 134.62,36.83 v132.08,31.75
N$27  (via drill 0.81)
  Top 0.406: E3.13 55.88,12.7 57.15,11.43 67.31,11.43 68.58,10.16 85.09,10.16 86.36,11.43 121.92,11.43 138.43,27.94 138.43,30.48 v139.7,31.75
  Bottom 0.406: E8.3 125.73,55.88 135.89,45.72 135.89,35.56 v139.7,31.75
N$28  (via drill 0.81)
  Top 0.406: v142.24,31.75 140.97,30.48 140.97,27.94 123.19,10.16 87.63,10.16 86.36,8.89 68.58,8.89 67.31,10.16 55.88,10.16 53.34,12.7 53.34,15.24 54.61,16.51 57.15,16.51 58.42,15.24 E3.14
  Bottom 0.406: E8.2 128.27,55.88 137.16,46.99 137.16,36.83 v142.24,31.75
N$29  (via drill 0.81)
  Top 0.406: v97.79,69.85 77.47,69.85 74.93,66.04 72.39,66.04 68.58,71.12 59.69,71.12 E12.14
  Bottom 0.406: E8.10 107.95,63.5 v97.79,69.85
N$30  (via drill 0.81)
  Top 0.406: E12.13 58.42,69.85 67.31,69.85 71.12,64.77 74.93,64.77 78.74,68.58 95.25,68.58 v97.79,66.04
  Bottom 0.406: E8.11 105.41,60.96 v97.79,66.04
N$31  (via drill 0.81)
  Top 0.406: E13.4 125.73,91.44 132.08,91.44 133.35,90.17 133.35,87.63 129.54,83.82 104.14,83.82 100.33,80.01 92.71,80.01 90.17,82.55 78.74,82.55 76.2,81.28 60.96,81.28 53.34,88.9 53.34,92.71 v52.07,93.98
  Bottom 0.406: E20.14 v52.07,93.98
N$32  (via drill 0.81)
  Top 0.406: E13.5 123.19,92.71 133.35,92.71 134.62,91.44 134.62,87.63 129.54,82.55 105.41,82.55 101.6,78.74 92.71,78.74 90.17,81.28 78.74,81.28 76.2,80.01 59.69,80.01 52.07,87.63 52.07,91.44 49.53,93.98 v49.53,95.25
  Bottom 0.406: E20.13 v49.53,95.25
N$33
  Bottom 0.406: E20.11 62.23,123.19 97.79,123.19 99.06,121.92 99.06,115.57 96.52,107.95 96.52,93.98 100.33,90.17 100.33,87.63 102.87,85.09 115.57,85.09 E13.6
N$34
  Bottom 0.406: E20.10 59.69,116.84 54.61,116.84 53.34,118.11 53.34,119.38 58.42,124.46 99.06,124.46 100.33,123.19 100.33,115.57 97.79,109.22 97.79,95.25 101.6,91.44 101.6,87.63 102.87,86.36 114.3,86.36 E13.7
N$35
  Top 0.406: E12.10 64.77,85.09 76.2,85.09 78.74,86.36 95.25,86.36 96.52,85.09 100.33,85.09 101.6,86.36 123.19,86.36 E13.3
N$36
  Top 0.406: E12.11 63.5,83.82 76.2,83.82 78.74,85.09 95.25,85.09 96.52,83.82 100.33,83.82 101.6,85.09 124.46,85.09 E13.2
N$37
  Bottom 0.406: E13.10 101.6,101.6 101.6,105.41 104.14,109.22 127,109.22 133.35,115.57 133.35,120.65 129.54,124.46 109.22,124.46 E21.11
N$38
  Bottom 0.406: E13.8 E21.14
N$39
  Bottom 0.406: E21.13 E13.9
N$40
  Bottom 0.406: E13.11 105.41,91.44 100.33,101.6 100.33,106.68 E21.10
N$41  (via drill 0.81)
  Top 0.406: U$3.AC1 8.89,10.16 15.24,10.16 21.59,3.81 49.53,3.81 v50.8,5.08 | E5.4 191.77,35.56 193.04,36.83 198.12,36.83 199.39,35.56 E5.1
  Bottom 0.406: E5.1 199.39,30.48 200.66,27.94 200.66,24.13 196.85,17.78 191.77,17.78 R5.1 185.42,19.05 180.34,15.24 180.34,5.08 176.53,1.27 52.07,1.27 v50.8,5.08
N$42  (via drill 0.81)
  Top 0.406: U$3.AD1 8.89,13.97 13.97,13.97 21.59,5.08 46.99,5.08 48.26,6.35 53.34,6.35 v54.61,5.08
  Bottom 0.406: E5.13 195.58,24.13 191.77,24.13 190.5,22.86 | 190.5,22.86 R6.1 185.42,21.59 181.61,17.78 179.07,16.51 179.07,6.35 175.26,2.54 55.88,2.54 v54.61,5.08 | E5.10 189.23,24.13 190.5,22.86
N$43
  Top 0.406: U$3.BU1 8.89,124.46 16.51,124.46 25.4,129.54 194.31,129.54 198.12,123.19 R14.1 209.55,118.11 209.55,85.09 204.47,80.01 204.47,74.93 205.74,72.39 205.74,69.85 204.47,68.58 203.2,68.58 200.66,72.39 196.85,72.39 | E15.10 190.5,72.39 196.85,72.39 | 196.85,72.39 E15.13
N$44
  Top 0.406: R13.1 189.23,121.92 189.23,119.38 191.77,116.84 204.47,116.84 205.74,115.57 205.74,90.17 204.47,88.9 201.93,88.9 E18.1 199.39,92.71 198.12,93.98 193.04,93.98 191.77,92.71 E18.4
  Bottom 0.406: U$3.BU2 8.89,124.46 49.53,124.46 53.34,129.54 179.07,129.54 184.15,127 189.23,123.19 R13.1
N$45
  Top 0.406: R12.1 193.04,118.11 204.47,118.11 207.01,115.57 207.01,88.9 205.74,87.63 200.66,87.63 E18.13 195.58,82.55 190.5,82.55 E18.10
  Bottom 0.406: U$3.BT2 8.89,121.92 49.53,121.92 54.61,128.27 179.07,128.27 184.15,125.73 184.15,124.46 189.23,120.65 R12.1
N$46
  Top 0.406: U$3.BT1 8.89,121.92 15.24,121.92 26.67,128.27 193.04,128.27 198.12,120.65 R11.1 208.28,116.84 208.28,85.09 E15.1 199.39,77.47 198.12,76.2 193.04,76.2 191.77,77.47 E15.4
N$47
  Top 0.406: U$3.AB1 8.89,7.62 13.97,7.62 17.78,6.35 21.59,2.54 198.12,2.54 203.2,7.62 203.2,16.51 201.93,17.78 201.93,20.32 R10.1 205.74,24.13 205.74,38.1 204.47,39.37 198.12,39.37 196.85,40.64 | 196.85,40.64 E9.13 196.85,40.64 | E9.10 189.23,40.64 190.5,39.37 195.58,39.37 196.85,40.64
N$48
  Top 0.406: U$3.AA1 7.62,3.81 17.78,3.81 20.32,1.27 199.39,1.27 204.47,6.35 204.47,17.78 R7.1 207.01,22.86 207.01,49.53 204.47,52.07 201.93,52.07 E9.1 199.39,48.26 198.12,46.99 193.04,46.99 191.77,48.26 E9.4
N$49
  Top 0.406: U$3.BV1 8.89,128.27 20.32,128.27 25.4,130.81 195.58,130.81 198.12,125.73 R8.1 210.82,118.11 210.82,83.82 205.74,78.74 205.74,74.93 207.01,72.39 207.01,62.23 204.47,58.42 201.93,58.42 199.39,60.96 E11.1 199.39,64.77 198.12,66.04 193.04,66.04 191.77,64.77 E11.4
N$50  (via drill 0.81)
  Top 0.406: v199.39,127 201.93,128.27 204.47,128.27 212.09,119.38 212.09,83.82 207.01,78.74 207.01,74.93 208.28,72.39 208.28,60.96 205.74,57.15 196.85,57.15 | 196.85,57.15 E11.13 | E11.10 189.23,57.15 190.5,58.42 195.58,58.42 196.85,57.15
  Bottom 0.406: U$3.BV2 10.16,128.27 49.53,128.27 52.07,130.81 179.07,130.81 185.42,128.27 189.23,125.73 R9.1 193.04,128.27 196.85,128.27 v199.39,127
N$51  (via drill 0.81)
  Top 0.406: E1.2 E1.3 E1.4 187.96,19.05 182.88,19.05 181.61,17.78 157.48,17.78 147.32,27.94 147.32,33.02 144.78,35.56 129.54,35.56 125.73,39.37 113.03,39.37 110.49,36.83 100.33,36.83 93.98,33.02 80.01,33.02 78.74,34.29 55.88,34.29 v53.34,36.83 | E14.11 31.75,71.12 36.83,62.23 36.83,53.34 33.02,49.53 v33.02,44.45
  Bottom 0.406: v33.02,44.45 34.29,43.18 40.64,43.18 44.45,39.37 50.8,39.37 v53.34,36.83
N$52  (via drill 0.81)
  Top 0.406: R2.1 160.02,36.83 129.54,36.83 125.73,40.64 113.03,40.64 110.49,38.1 100.33,38.1 93.98,34.29 80.01,34.29 78.74,35.56 58.42,35.56 v53.34,39.37 | v36.83,44.45 36.83,52.07 38.1,53.34 38.1,62.23 34.29,71.12 E14.12
  Bottom 0.406: v36.83,44.45 40.64,44.45 44.45,40.64 52.07,40.64 v53.34,39.37 | DL1.11 113.03,16.51 153.67,16.51 165.1,27.94 R2.1
N$53  (via drill 0.81)
  Top 0.406: E2.1 38.1,17.78 43.18,17.78 49.53,11.43 50.8,11.43 52.07,12.7 52.07,17.78 44.45,22.86 44.45,35.56 52.07,41.91 v52.07,43.18 | v45.72,43.18 43.18,46.99 43.18,60.96 40.64,67.31 40.64,69.85 41.91,71.12 45.72,71.12 46.99,72.39 v46.99,78.74 46.99,88.9 48.26,90.17 48.26,97.79 54.61,95.25 58.42,91.44 76.2,91.44 77.47,92.71 86.36,92.71 87.63,91.44 92.71,91.44 93.98,92.71 99.06,92.71 100.33,91.44 119.38,91.44 121.92,96.52 152.4,96.52 153.67,97.79 E19.8
  Bottom 0.406: v45.72,43.18 v52.07,43.18 | E2.8 21.59,10.16 24.13,12.7 34.29,12.7 36.83,15.24 E2.1 | E14.5 27.94,80.01 30.48,80.01 E14.3 33.02,80.01 38.1,80.01 39.37,81.28 39.37,82.55 40.64,83.82 43.18,83.82 46.99,81.28 v46.99,78.74
N$54  (via drill 0.81)
  Top 0.406: v90.17,6.35 88.9,5.08 58.42,5.08 54.61,8.89 50.8,8.89 45.72,12.7 33.02,12.7 31.75,13.97 21.59,13.97 19.05,16.51 19.05,21.59 13.97,26.67 8.89,26.67 U$3.AJ1 | E13.22 128.27,69.85 135.89,69.85 137.16,71.12 142.24,71.12 147.32,74.93 v149.86,74.93 | E5.2 193.04,30.48 182.88,30.48 179.07,34.29 179.07,38.1 177.8,40.64 172.72,41.91 163.83,41.91 E6.12
  Bottom 0.406: v90.17,6.35 91.44,5.08 95.25,5.08 106.68,20.32 152.4,20.32 E6.12 160.02,44.45 154.94,44.45 152.4,46.99 152.4,53.34 148.59,58.42 148.59,60.96 147.32,62.23 147.32,64.77 148.59,67.31 148.59,71.12 v149.86,74.93 | E5.2 198.12,36.83 200.66,36.83 201.93,35.56 201.93,29.21 207.01,21.59 207.01,17.78 200.66,11.43 190.5,11.43 E1.5
N$55  (via drill 0.81)
  Top 0.406: U$3.AH1 8.89,22.86 15.24,22.86 17.78,20.32 17.78,16.51 21.59,12.7 30.48,12.7 31.75,11.43 45.72,11.43 50.8,7.62 54.61,7.62 58.42,3.81 90.17,3.81 92.71,6.35 v92.71,7.62 93.98,8.89 140.97,8.89 147.32,15.24 182.88,15.24 184.15,16.51 185.42,16.51 186.69,15.24 E1.6 | E8.22 129.54,39.37 143.51,39.37 153.67,43.18 157.48,43.18 E6.11 162.56,43.18 172.72,43.18 177.8,41.91 180.34,39.37 180.34,34.29 181.61,33.02 185.42,33.02 E5.6
  Bottom 0.406: E6.11 151.13,22.86 105.41,22.86 v92.71,7.62
N$56  (via drill 0.81)
  Top 0.406: U$3.AV1 8.89,58.42 21.59,58.42 v22.86,59.69 | v97.79,87.63 85.09,87.63 E12.1 | v149.86,77.47 146.05,77.47 144.78,78.74 140.97,78.74 137.16,74.93 124.46,74.93 E13.21 | E6.10 157.48,39.37 158.75,38.1 166.37,38.1 175.26,29.21 189.23,29.21 E5.11
  Bottom 0.406: E12.1 77.47,80.01 53.34,80.01 43.82,64.77 33.02,64.77 31.75,66.04 26.67,66.04 24.13,63.5 24.13,60.96 v22.86,59.69 | E13.21 116.84,81.28 104.14,81.28 v97.79,87.63 | E6.10 156.21,43.18 153.67,43.18 151.13,45.72 151.13,53.34 147.32,58.42 147.32,60.96 146.05,62.23 146.05,64.77 147.32,67.31 147.32,71.12 148.59,76.2 v149.86,77.47
N$58  (via drill 0.81)
  Top 0.406: v97.79,90.17 96.52,88.9 87.63,88.9 85.09,91.44 78.74,91.44 E12.4 | E13.20 127,66.04 135.89,66.04 138.43,64.77 140.97,64.77 148.59,68.58 151.13,68.58 153.67,67.31 165.1,67.31 E10.15 | E9.2 194.31,53.34 182.88,53.34 180.34,55.88 176.53,55.88 175.26,54.61 v167.64,54.61
  Bottom 0.406: U$3.BD2 8.89,83.82 38.1,83.82 39.37,85.09 44.45,85.09 48.26,82.55 72.39,82.55 E12.4 | E13.20 116.84,78.74 104.14,78.74 97.79,85.09 96.52,85.09 95.25,86.36 95.25,88.9 v97.79,90.17 | E10.15 v167.64,54.61
N$60  (via drill 0.81)
  Top 0.406: E20.20 76.2,100.33 86.36,100.33 87.63,99.06 100.33,99.06 101.6,97.79 111.76,97.79 v113.03,99.06 | E13.19 124.46,64.77 134.62,64.77 137.16,63.5 140.97,63.5 148.59,67.31 151.13,67.31 153.67,66.04 161.29,66.04 E10.13 168.91,59.69 193.04,59.69 E11.2
  Bottom 0.406: U$3.BH2 8.89,92.71 16.51,92.71 17.78,93.98 17.78,97.79 21.59,102.87 36.83,102.87 48.26,107.95 71.12,107.95 E20.20 | E13.19 120.65,71.12 130.81,71.12 133.35,73.66 133.35,74.93 132.08,76.2 132.08,86.36 133.35,87.63 133.35,91.44 120.65,99.06 v113.03,99.06
N$62  (via drill 0.81)
  Top 0.406: v110.49,99.06 101.6,99.06 100.33,100.33 87.63,100.33 86.36,101.6 82.55,101.6 E20.23 | E13.18 121.92,63.5 133.35,63.5 135.89,62.23 140.97,62.23 148.59,66.04 151.13,66.04 153.67,64.77 160.02,64.77 E10.12 161.29,60.96 161.29,58.42 162.56,57.15 180.34,57.15 182.88,54.61 190.5,54.61 E11.11
  Bottom 0.406: E20.23 76.2,110.49 46.99,110.49 35.56,105.41 20.32,105.41 15.24,99.06 8.89,99.06 U$3.BK2 | E13.18 119.38,69.85 132.08,69.85 134.62,72.39 134.62,76.2 133.35,77.47 133.35,85.09 134.62,86.36 134.62,92.71 118.11,101.6 113.03,101.6 v110.49,99.06
N$63  (via drill 0.81)
  Top 0.406: U$3.BS1 8.89,118.11 13.97,118.11 26.67,127 171.45,127 v173.99,123.19 | E19.9 162.56,95.25 167.64,95.25 168.91,93.98 v179.07,93.98
  Bottom 0.406: v173.99,123.19 175.26,121.92 175.26,118.11 176.53,116.84 176.53,96.52 v179.07,93.98
N$64  (via drill 0.81)
  Top 0.406: E13.17 120.65,62.23 133.35,62.23 135.89,60.96 142.24,60.96 148.59,64.77 151.13,64.77 153.67,63.5 156.21,63.5 E10.10 157.48,60.96 162.56,55.88 163.83,55.88 166.37,53.34 175.26,53.34 176.53,52.07 177.8,52.07 185.42,44.45 189.23,44.45 E9.11 | E20.1 86.36,120.65 v96.52,120.65
  Bottom 0.406: U$3.BL2 10.16,102.87 16.51,102.87 19.05,106.68 34.29,106.68 46.99,111.76 78.74,111.76 E20.1 | E13.17 110.49,77.47 102.87,77.47 96.52,83.82 95.25,83.82 93.98,85.09 93.98,90.17 95.25,91.44 95.25,97.79 93.98,99.06 93.98,107.95 v96.52,120.65
N$65  (via drill 0.81)
  Top 0.406: U$3.AT1 8.89,52.07 20.32,52.07 26.67,58.42 v26.67,59.69 | v153.67,76.2 154.94,77.47 172.72,77.47 173.99,78.74 180.34,78.74 E15.8 | E8.13 115.57,54.61 130.81,54.61 134.62,59.69 142.24,59.69 148.59,63.5 v149.86,63.5 | E12.20 76.2,71.12 95.25,71.12 v97.79,73.66
  Bottom 0.406: E8.13 95.25,49.53 95.25,52.07 93.98,53.34 93.98,55.88 96.52,58.42 96.52,64.77 95.25,66.04 95.25,71.12 v97.79,73.66 | E12.20 71.12,77.47 55.25,77.47 45.72,62.23 30.48,62.23 v26.67,59.69 | E16.9 v153.67,76.2 149.86,72.39 v149.86,63.5
N$66  (via drill 0.81)
  Top 0.406: U$3.BM1 10.16,105.41 13.97,105.41 30.48,121.92 39.37,121.92 57.15,111.76 77.47,111.76 78.74,113.03 125.73,113.03 E21.1 130.81,109.22 v133.35,106.68 | v162.56,74.93 165.1,76.2 172.72,76.2 173.99,77.47 179.07,77.47 181.61,72.39 181.61,69.85 182.88,68.58 189.23,68.58 E15.11 | E16.10 154.94,85.09 144.78,85.09 142.24,87.63 138.43,87.63 130.81,80.01 109.22,80.01 E13.13
  Bottom 0.406: E13.13 109.22,66.04 134.62,66.04 138.43,71.12 138.43,77.47 137.16,78.74 137.16,82.55 138.43,83.82 138.43,95.25 133.35,97.79 v133.35,106.68 | E16.10 v162.56,74.93
N$67  (via drill 0.81)
  Top 0.406: E8.14 115.57,53.34 131.45,53.34 135.26,58.42 143.51,58.42 v146.05,59.69 | E18.6 184.15,88.9 167.64,88.9 165.1,86.36 163.83,86.36 E16.11 | E7.4 78.74,55.88 93.98,55.88 v97.79,57.15
  Bottom 0.406: U$3.AU2 10.16,54.61 15.24,54.61 16.51,55.88 41.91,55.88 43.18,54.61 73.66,54.61 E7.4 | E8.14 104.14,45.72 101.6,45.72 96.52,49.53 96.52,54.61 v97.79,57.15 | E16.11 158.75,85.09 149.86,85.09 146.05,71.12 146.05,67.31 144.78,64.77 144.78,60.96 v146.05,59.69
N$68
  Top 0.406: U$3.BL1 8.89,102.87 15.24,102.87 30.48,120.65 38.1,120.65 55.88,110.49 77.47,110.49 78.74,111.76 119.38,111.76 E21.23 | E18.2 193.04,87.63 167.64,87.63 E16.12 161.29,81.28 152.4,81.28 151.13,82.55 146.05,82.55 142.24,86.36 139.7,86.36 132.08,78.74 110.49,78.74 E13.14
  Bottom 0.406: E13.14 110.49,67.31 133.35,67.31 137.16,72.39 137.16,77.47 135.89,78.74 135.89,83.82 137.16,85.09 137.16,93.98 135.89,95.25 128.27,99.06 E21.23
N$70
  Top 0.406: U$3.BJ1 8.89,96.52 15.24,96.52 31.75,118.11 38.1,118.11 53.34,107.95 77.47,107.95 78.74,109.22 114.3,109.22 E21.20 | E13.15 111.76,77.47 132.08,77.47 139.7,85.09 142.24,85.09 146.05,81.28 151.13,81.28 152.4,80.01 163.2,80.01 E16.13 168.91,86.36 189.23,86.36 E18.11
  Bottom 0.406: E13.15 111.76,68.58 132.08,68.58 135.89,72.39 135.89,77.47 134.62,78.74 134.62,85.09 135.89,86.36 135.89,93.98 120.65,101.6 E21.20
N$72  (via drill 0.81)
  Top 0.406: E15.2 194.31,81.28 189.23,81.28 187.96,82.55 181.61,82.55 180.34,83.82 175.26,83.82 175.26,82.55 173.99,81.28 171.45,81.28 E16.15 167.64,78.74 151.13,78.74 149.86,80.01 146.05,80.01 142.24,83.82 139.7,83.82 132.08,76.2 113.03,76.2 E13.16 | E20.4 80.01,123.19 97.79,123.19 99.06,121.92 99.06,120.65 97.79,119.38 v93.98,119.38
  Bottom 0.406: E20.4 73.66,114.3 46.99,114.3 34.29,109.22 8.89,109.22 U$3.BN2 | E13.16 109.22,76.2 99.06,76.2 92.71,81.28 92.71,91.44 93.98,92.71 93.98,97.79 92.71,99.06 92.71,118.11 v93.98,119.38
N$73
  ECO 0.406: E12.23 82.55,72.39 85.09,72.39 86.36,73.66 86.36,104.14 101.6,119.38 121.92,119.38 E21.4 124.46,119.38 132.08,119.38 134.62,116.84 134.62,60.96 146.05,49.53 158.75,49.53 E6.6
N$74  (via drill 0.81)
  Top 0.406: E12.19 v73.66,68.58 | U$3.AS1 8.89,48.26 13.97,48.26 17.78,50.8 21.59,50.8 v30.48,59.69 | E21.3 123.19,120.65 102.87,120.65 100.33,118.11 v88.9,118.11
  Bottom 0.406: E12.19 69.85,76.2 55.88,76.2 45.72,59.69 v30.48,59.69 | v73.66,68.58 80.01,68.58 86.36,72.39 86.36,73.66 83.82,77.47 83.82,82.55 87.63,87.63 87.63,115.57 88.9,116.84 v88.9,118.11
N$76  (via drill 0.81)
  Top 0.406: U$3.AU1 8.89,54.61 20.32,54.61 24.13,58.42 24.13,59.69 v26.67,62.23 | v86.36,118.11 87.63,116.84 116.84,116.84 E21.6
  Bottom 0.406: E12.22 78.74,78.74 | 78.74,78.74 54.61,78.74 45.09,63.5 29.21,63.5 v26.67,62.23 | 78.74,78.74 86.36,87.63 v86.36,118.11
N$77
  Top 0.406: U$3.AL1 8.89,33.02 13.97,33.02 19.05,26.67 31.75,26.67 34.29,29.21 E4.13
N$78  (via drill 0.81)
  Top 0.406: U$3.BA1 8.89,73.66 16.51,73.66 17.78,72.39 17.78,67.31 v22.86,62.23
  Bottom 0.406: E12.2 76.2,81.28 52.07,81.28 43.18,66.04 33.02,66.04 31.75,67.31 25.4,67.31 22.86,63.5 v22.86,62.23
N$80
  Bottom 0.406: E12.5 71.12,83.82 49.53,83.82 45.72,86.36 39.37,86.36 38.1,85.09 20.32,85.09 19.05,86.36 8.89,86.36 U$3.BE2
N$82
  Bottom 0.406: U$3.BF2 10.16,90.17 16.51,90.17 19.05,92.71 19.05,96.52 22.86,101.6 38.1,101.6 49.53,106.68 68.58,106.68 E20.19
N$84
  Bottom 0.406: U$3.BJ2 10.16,96.52 15.24,96.52 16.51,97.79 16.51,99.06 20.32,104.14 36.83,104.14 48.26,109.22 74.93,109.22 E20.22
N$86
  Bottom 0.406: E20.2 77.47,113.03 46.99,113.03 34.29,107.95 17.78,107.95 16.51,105.41 8.89,105.41 U$3.BM2
N$88
  Bottom 0.406: E20.5 72.39,115.57 46.99,115.57 34.29,110.49 15.24,111.76 8.89,111.76 U$3.BP2
N$90
  Top 0.406: U$3.BH1 10.16,92.71 13.97,92.71 33.02,116.84 36.83,116.84 53.34,106.68 77.47,106.68 78.74,107.95 113.03,107.95 E21.19
N$92
  Top 0.406: U$3.BK1 8.89,99.06 13.97,99.06 31.75,119.38 38.1,119.38 54.61,109.22 77.47,109.22 78.74,110.49 118.11,110.49 E21.22
N$95
  Top 0.406: U$3.BN1 8.89,109.22 15.24,109.22 29.21,123.19 39.37,123.19 57.15,113.03 77.47,113.03 78.74,114.3 124.46,114.3 E21.2
N$96
  Top 0.406: U$3.BP1 8.89,111.76 13.97,111.76 27.94,124.46 40.64,124.46 57.15,114.3 77.47,114.3 78.74,115.57 118.11,115.57 E21.5
N$97
  Top 0.406: U$3.AM1 8.89,35.56 15.24,35.56 21.59,27.94 E4.9
N$98
  Bottom 0.406: E16.5 163.83,86.36 172.72,86.36 173.99,85.09 173.99,81.28 171.45,78.74 E10.4
N$99
  Bottom 0.406: E16.6 161.29,92.71 172.72,92.71 179.07,85.09 179.07,81.28 177.8,80.01 175.26,80.01 172.72,77.47 167.64,71.12 E10.3
N$100
  Bottom 0.406: E16.7 158.75,93.98 173.99,93.98 180.34,87.63 180.34,80.01 179.07,78.74 175.26,78.74 173.99,77.47 170.18,72.39 E10.2
N$101
  Bottom 0.406: E6.4 163.83,50.8 156.21,50.8 154.94,52.07 154.94,58.42 152.4,62.23 152.4,71.12 153.67,72.39 160.02,72.39 E10.5
N$102
  Bottom 0.406: E6.3 168.91,45.72 172.72,45.72 173.99,46.99 173.99,55.88 175.26,59.69 175.26,64.77 172.72,67.31 161.29,67.31 E10.6
N$103
  Bottom 0.406: E10.7 160.02,66.04 172.72,66.04 173.99,64.77 173.99,59.69 E6.2
N$104
  Top 0.406: E4.12 31.75,29.21 30.48,27.94 27.94,27.94 26.67,29.21 E4.10 25.4,31.75 20.32,31.75 13.97,39.37 8.89,39.37 U$3.AN1
N$105
  Top 0.406: U$3.BD1 8.89,83.82 22.86,83.82 E14.6
N$106
  Top 0.406: U$3.BC1 8.89,80.01 33.02,80.01 E14.2
N$107
  Top 0.406: E17.10 E14.4
  Bottom 0.406: E17.10 E17.5
N$108
  Top 0.406: U$3.AE1 8.89,16.51 15.24,16.51 21.59,10.16 22.86,10.16 E2.9
  Bottom 0.406: E2.9 E2.10
N$109
  Top 0.406: U$3.AF1 8.89,20.32 13.97,20.32 16.51,17.78 16.51,16.51 21.59,11.43 29.21,11.43 E2.12
N$110
  Bottom 0.406: E2.13 31.75,6.35 21.59,6.35 20.32,7.62 20.32,11.43 24.13,15.24 E2.6
N$112  (via drill 0.81)
  Top 0.406: E2.2 39.37,26.67 39.37,30.48 38.1,31.75 26.67,31.75 25.4,33.02 20.32,33.02 17.78,36.83 17.78,39.37 19.05,41.91 21.59,41.91 24.13,44.45 24.13,50.8 31.75,58.42 31.75,60.96 26.67,66.04 20.32,66.04 19.05,67.31 v19.05,76.2
  Bottom 0.406: U$3.BB2 8.89,77.47 13.97,77.47 v19.05,76.2
N$113
  Top 0.406: U$3.AK1 8.89,29.21 15.24,29.21 E2.5
  Bottom 0.406: E2.5 E2.4
N$114
  Top 0.406: E14.1 E17.13 E17.1
N$115
  Top 0.406: U$3.BE1 8.89,86.36 22.86,86.36 E17.9 24.13,88.9 25.4,90.17 30.48,90.17 31.75,88.9 E17.12
N$116  (via drill 0.81)
  Top 0.406: E4.1 41.91,43.18 41.91,60.96 39.37,67.31 39.37,71.12 40.64,72.39 44.45,72.39 45.72,73.66 45.72,88.9 46.99,90.17 46.99,97.79 v45.72,99.06
  Bottom 0.406: E17.8 20.32,88.9 20.32,96.52 24.13,100.33 38.1,100.33 40.64,101.6 43.18,101.6 v45.72,99.06
N$117  (via drill 0.81)
  Top 0.406: v39.37,99.06 41.91,99.06 45.72,95.25 45.72,90.17 44.45,88.9 44.45,74.93 43.18,73.66 39.37,73.66 38.1,72.39 38.1,67.31 40.64,60.96 40.64,44.45 36.83,40.64 31.75,40.64 E4.4
  Bottom 0.406: E17.11 33.02,93.98 41.91,93.98 43.18,95.25 43.18,99.06 41.91,100.33 40.64,100.33 v39.37,99.06
N$118  (via drill 0.81)
  Top 0.406: v34.29,114.3 38.1,114.3 53.34,105.41 v53.34,104.14 | v41.91,88.9 40.64,87.63 40.64,80.01 v41.91,78.74
  Bottom 0.406: E14.8 24.13,77.47 39.37,77.47 v41.91,78.74 | U$3.BS2 8.89,118.11 15.24,118.11 v34.29,114.3 | v53.34,104.14 46.99,97.79 46.99,92.71 v41.91,88.9
N$120
  Top 0.406: E19.10 E19.11 | E22.9 160.02,115.57 161.29,116.84 166.37,116.84 167.64,115.57 E22.12
  Bottom 0.406: E22.12 168.91,116.84 173.99,116.84 175.26,115.57 175.26,104.14 172.72,101.6 167.64,101.6 E19.11 E19.10
N$121
  Top 0.406: E1.8 181.61,8.89 158.75,8.89 DL1.3
N$122
  Bottom 0.406: DL1.1 168.91,6.35 168.91,30.48 R1.1 175.26,40.64 177.8,40.64 181.61,44.45 181.61,64.77 179.07,71.12 177.8,71.12 175.26,73.66 175.26,76.2 176.53,77.47 180.34,77.47 181.61,78.74 181.61,87.63 173.99,95.25 171.45,95.25 E19.13
N$123
  Top 0.406: E1.11 187.96,10.16 147.32,10.16 DL1.5
N$125
  Top 0.406: E1.12 E1.1
  Bottom 0.406: E1.9 189.23,3.81 191.77,3.81 E1.12
N$129  (via drill 0.81)
  Bottom 0.406: E23.11 C27.2 v184.15,101.6
N$131  (via drill 0.81)
  Top 0.406: E23.4 E23.3 198.12,110.49 v203.2,110.49
  Bottom 0.406: E1.13 198.12,10.16 200.66,10.16 208.28,17.78 208.28,21.59 207.01,24.13 207.01,107.95 v203.2,110.49
N$132
  Top 0.406: E19.12 168.91,96.52 173.99,96.52 E23.8
N$133
  Bottom 0.406: E23.13 C27.1 193.04,97.79 R15.1
N$134
  Bottom 0.406: E19.1 170.18,107.95 167.64,107.95 E22.10
N$140
  Top 0.406: E17.3 38.1,104.14 46.99,104.14 50.8,100.33 57.15,96.52 64.77,96.52 67.31,93.98 87.63,93.98 88.9,92.71 91.44,92.71 92.71,93.98 100.33,93.98 101.6,92.71 116.84,92.71 121.29,99.06 144.78,99.06 146.05,100.33 146.05,116.84 147.32,118.11 168.91,118.11 E22.1
N$141
  Top 0.406: E17.6 24.13,97.79 36.83,105.41 46.99,105.41 50.8,101.6 57.15,97.79 66.04,97.79 68.58,95.25 87.63,95.25 88.9,93.98 91.44,93.98 92.71,95.25 100.33,95.25 101.6,93.98 116.21,93.98 120.65,100.33 143.51,100.33 144.78,101.6 144.78,116.84 147.32,119.38 162.56,119.38 E22.4
N$142
  Bottom 0.406: E22.11 E22.2
N$143  (via drill 0.81)
  Top 0.406: v123.19,93.98 134.62,93.98 137.16,91.44 137.16,88.9 129.54,81.28 107.95,81.28 100.33,73.66 100.33,64.77 99.06,63.5 96.52,63.5 93.98,66.04 78.74,66.04 76.2,63.5 71.12,63.5 69.85,62.23 57.15,62.23 54.61,64.77 48.26,64.77 45.72,62.23 45.72,57.15 48.26,54.61 48.26,43.18 43.18,38.1 39.37,38.1 36.83,35.56 34.29,35.56 E4.3
  Bottom 0.406: E13.1 130.81,90.17 124.46,93.98 v123.19,93.98
N$144
  Top 0.406: E8.1 130.81,59.69 129.54,60.96 95.25,60.96 91.44,64.77 78.74,64.77 76.2,62.23 72.39,62.23 71.12,60.96 57.15,60.96 54.61,63.5 48.26,63.5 46.99,62.23 46.99,57.15 49.53,54.61 49.53,41.91 43.18,35.56 43.18,34.29 41.91,33.02 40.64,33.02 39.37,34.29 27.94,34.29 E4.6
N$145
  Bottom 0.406: E22.8 E22.5
N$148
  Top 0.406: U$3.BF1 8.89,90.17 22.86,90.17 25.4,92.71 29.21,92.71 | E17.4 29.21,92.71 | 29.21,92.71 33.02,92.71 34.29,93.98 E17.2
N$149  (via drill 0.81)
  Top 0.406: v148.59,46.99 151.13,48.26 152.4,49.53 156.21,49.53 E6.7 | E19.3 E19.2
  Bottom 0.406: U$3.BR2 10.16,115.57 13.97,115.57 34.29,111.76 46.99,116.84 57.15,125.73 137.16,125.73 139.7,123.19 139.7,116.84 140.97,115.57 143.51,115.57 147.32,111.76 161.29,111.76 E19.3 | E19.3 E19.2 170.18,104.14 171.45,102.87 172.72,102.87 173.99,104.14 173.99,106.68 E22.13 | E19.3 162.56,100.33 156.21,100.33 152.4,95.25 152.4,92.71 151.13,91.44 147.32,91.44 143.51,87.63 143.51,80.01 144.78,78.74 144.78,77.47 143.51,76.2 143.51,67.31 142.24,64.77 142.24,55.88 147.32,52.07 147.32,49.53 v148.59,46.99
SHIFT_CLOCK
  Top 0.406: E4.5 30.48,43.18 30.48,49.53 35.56,54.61 35.56,62.23 29.21,71.12 E14.10
  Bottom 0.406: E4.5 26.67,36.83 27.94,35.56 33.02,35.56 34.29,36.83 E4.2
START
  Top 0.406: U$3.BB1 8.89,77.47 15.24,77.47 17.78,78.74 20.32,78.74 22.86,76.2 31.75,76.2 E14.13
VCC  (via drill 0.81)
  Top 0.813: R5.2 R6.2 182.88,24.13 193.04,24.13 | R7.2 R10.2 193.04,24.13 | 199.39,24.13 E5.14 C5.1 | 199.39,24.13 193.04,24.13 | 199.39,24.13 199.39,16.51 201.93,13.97 201.93,8.89 E1.14 196.85,3.81 175.26,3.81 173.99,5.08 C1.1 | E23.14 C23.1 203.2,101.6 R15.2 | E18.14 C18.1 | C15.1 E15.14 | E11.14 C11.1 | E9.14 C9.1 | R8.2 R14.2 R11.2 | R9.2 R13.2 R12.2 173.99,113.03 | C14.1 39.37,78.74 39.37,91.44 | 39.37,91.44 C17.1 | E2.14 C2.1 43.18,7.62 C25.+ | v49.53,13.97 49.53,16.51 41.91,21.59 C4.1 38.1,33.02 27.31,33.02 24.77,35.56 20.32,35.56 19.05,36.83 19.05,39.37 20.32,40.64 22.86,40.64 25.4,43.18 25.4,49.53 33.02,57.15 33.02,60.96 29.21,66.04 26.67,68.58 C24.+ | E6.16 C6.1 | C10.1 E10.16 | E8.24 C8.1 | v63.5,93.98 58.42,93.98 57.15,95.25 49.53,99.06 45.72,102.87 39.37,102.87 36.83,100.33 36.83,99.06 39.37,96.52 39.37,91.44 | E3.24 C3.1 | E12.24 93.98,73.66 C12.1 | E21.24 C21.1 v142.24,101.6 | E22.14 173.99,113.03 | 173.99,113.03 171.45,110.49 157.48,110.49 C22.1 147.32,111.76 147.32,104.14 C19.1 153.67,101.6 168.91,101.6 E19.14 | E13.24 132.08,72.39 133.35,72.39 134.62,73.66 139.7,73.66 C13.1 | E7.24 87.63,44.45 C7.1 | C16.1 v140.97,91.44
  Bottom 0.813: U$3.AA2 10.16,4.13 10.16,3.81 44.45,3.81 C25.+ 60.96,7.62 63.5,5.08 83.82,5.08 91.44,12.7 | 91.44,12.7 C3.1 88.9,16.51 88.9,27.94 93.98,33.02 C7.1 93.98,46.99 91.44,49.53 91.44,52.07 92.71,53.34 92.71,57.15 95.25,59.69 95.25,62.23 93.98,63.5 93.98,73.66 C12.1 | 91.44,12.7 104.14,25.4 142.24,25.4 146.05,29.21 146.05,35.56 140.97,40.64 C8.1 143.51,46.99 143.51,50.8 139.7,53.34 139.7,66.04 140.97,67.31 C13.1 138.43,80.01 138.43,81.28 139.7,82.55 139.7,90.17 v140.97,91.44 139.7,96.52 137.16,99.06 C21.1 | R1.2 171.45,39.37 E6.16 173.99,41.91 176.53,41.91 180.34,45.72 180.34,63.5 C10.1 | C1.1 177.8,11.43 177.8,19.05 | 177.8,19.05 R5.2 | C6.1 177.8,38.1 177.8,19.05 | U$3.BA2 10.16,73.66 17.78,73.66 C24.+ 24.13,71.12 39.37,71.12 41.91,73.66 C14.1 E14.14 | E4.14 C4.1 | E17.14 40.64,91.44 C17.1 | v63.5,93.98 81.28,93.98 C20.1 E20.24 | C22.1 151.13,115.57 152.4,116.84 152.4,121.92 151.13,123.19 R3.2 | C19.1 v142.24,101.6 | E16.16 172.72,83.82 171.45,85.09 161.29,85.09 158.75,87.63 C16.1 | R9.2 R13.2 R12.2 181.61,116.84 | 181.61,116.84 190.5,116.84 R11.2 R14.2 R8.2 | E23.14 199.39,107.95 198.12,109.22 182.88,109.22 181.61,110.49 181.61,116.84 | v49.53,13.97 44.45,13.97 41.91,11.43 C2.1 | 205.74,54.61 205.74,66.04 | 205.74,66.04 C15.1 | C5.1 205.74,34.29 205.74,41.91 | C9.1 205.74,41.91 | 205.74,41.91 205.74,54.61 | 205.74,54.61 C11.1 | C18.1 205.74,85.09 | 205.74,85.09 205.74,66.04 | C23.1 205.74,104.14 205.74,85.09
X_STROBE
  Bottom 0.406: E5.9 E5.5 E9.9 E9.5 E11.9 E11.6 E15.9 E15.6 E18.9 E18.5 186.69,93.98 182.88,93.98 177.8,99.06 177.8,116.84 176.53,118.11 176.53,124.46 175.26,125.73 170.18,125.73 E22.3
Y_STROBE
  Bottom 0.406: E5.12 E5.3 E9.12 E9.3 E11.12 E11.3 E15.12 E15.3 E18.12 E18.3 191.77,95.25 184.15,95.25 179.07,100.33 179.07,116.84 177.8,119.38 177.8,124.46 175.26,127 163.83,127 E22.6

## Text on the board
Top: + | FLIP CHIP | +
Bottom: M7010B | CS*ABCDEFHJKLMNPRSTUVW
Document: Do not etch ECO layer.